# Altium schematic sheet Sheet1_V4.1.SchDoc
size A2
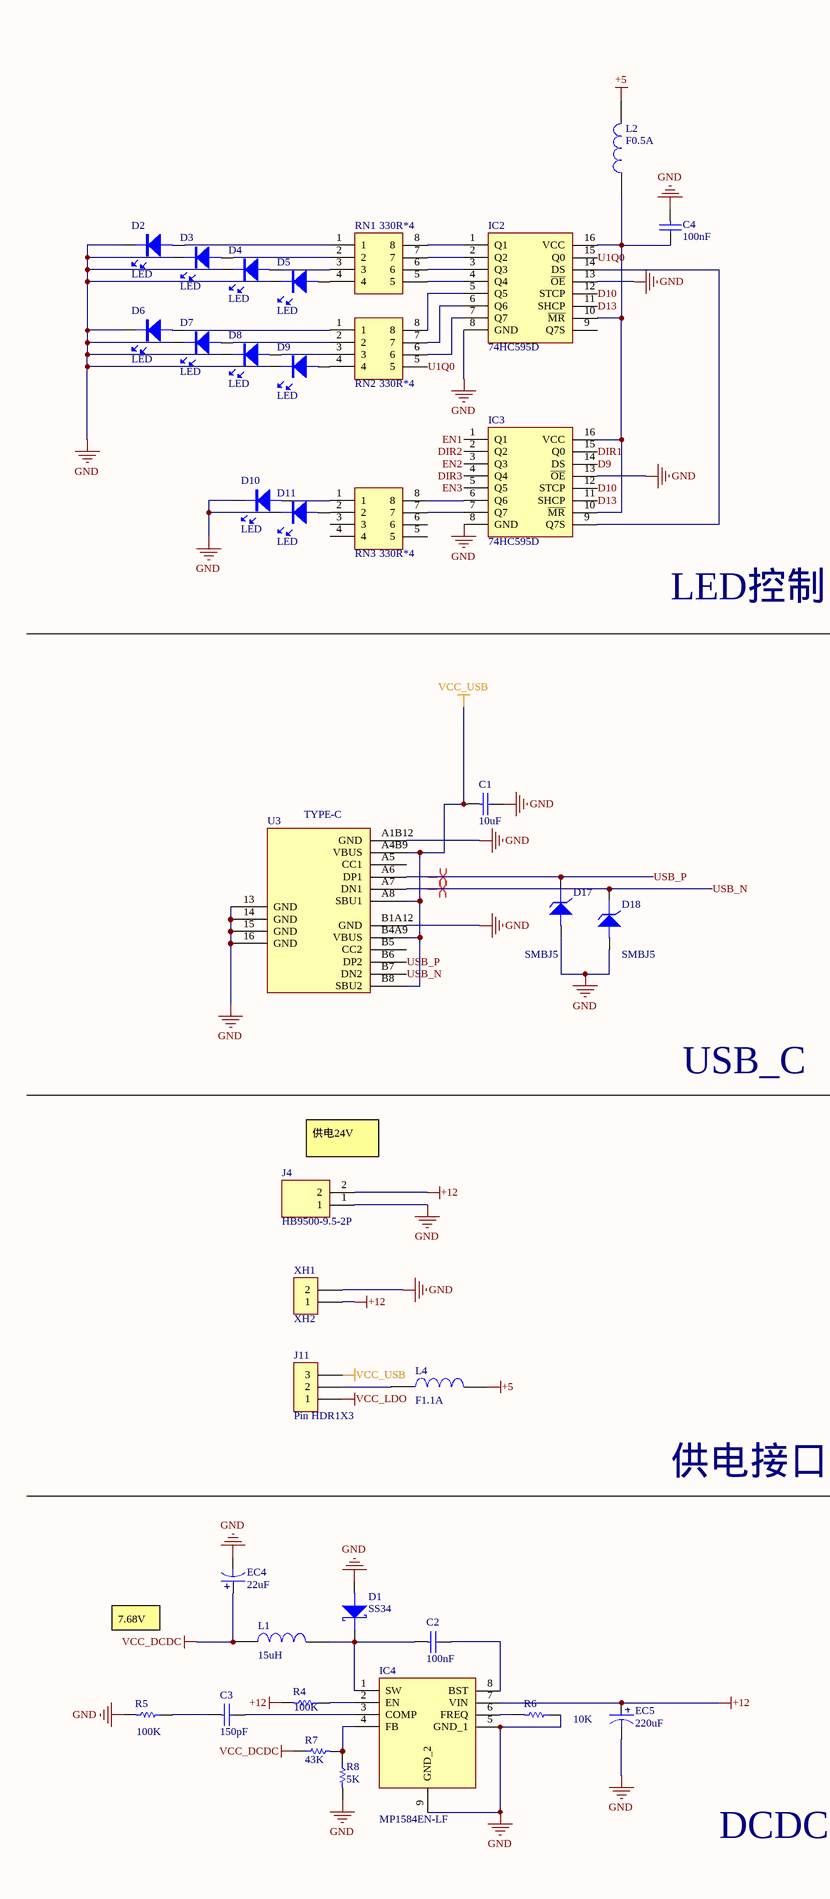
[diagram p0: Sheet1_V4.1.SchDoc, left]
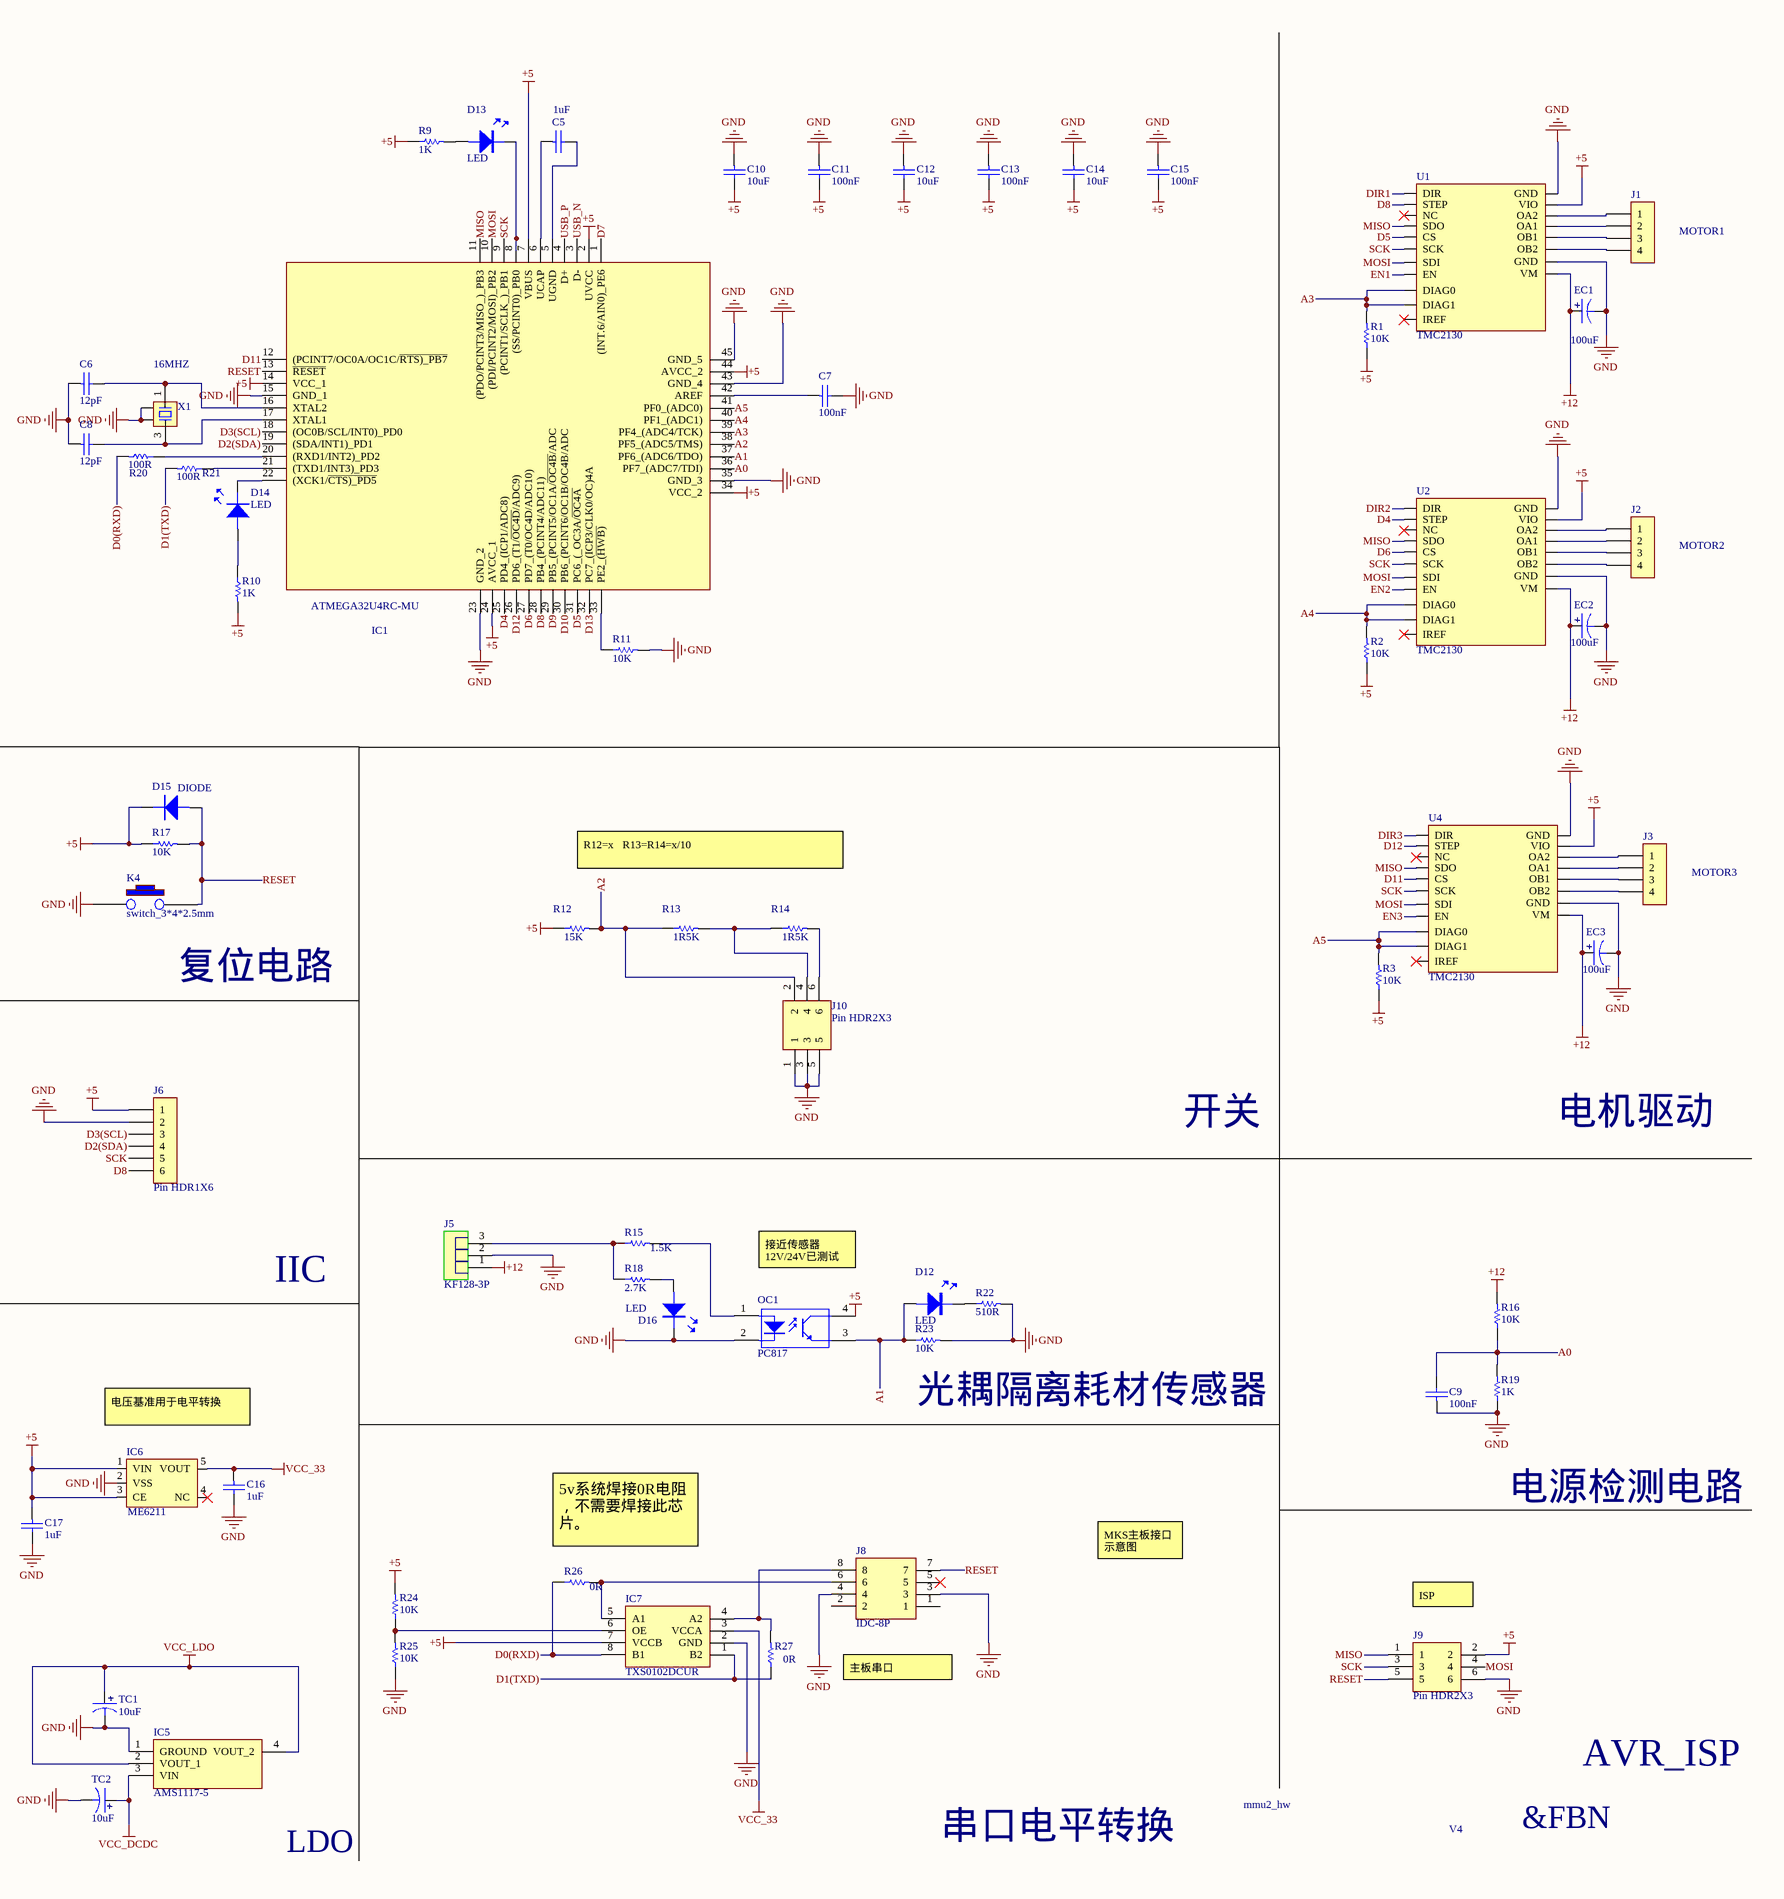
[diagram p1: Sheet1_V4.1.SchDoc, right]

## Parts
C1  10uF  [0402C]
C2  100nF  [0402C]
C3  150pF  [0402C]
C4  100nF  [0402C]
C5  1uF  [0402C]
C6  12pF  [0402C]
C7  100nF  [0402C]
C8  12pF  [0402C]
C9  100nF  [0402C]
C10  10uF  [0402C]
C11  100nF  [0402C]
C12  10uF  [0402C]
C13  100nF  [0402C]
C14  10uF  [0402C]
C15  100nF  [0402C]
C16  1uF  [0402C]
C17  1uF  [0402C]
D1  SS34  [SMA/DO-214AC]
D2  LED  [LED-0603G]
D3  LED  [LED-0603B]
D4  LED  [LED-0603G]
D5  LED  [LED-0603B]
D6  LED  [LED-0603G]
D7  LED  [LED-0603B]
D8  LED  [LED-0603G]
D9  LED  [LED-0603B]
D10  LED  [LED-0603G]
D11  LED  [LED-0603B]
D12  LED  [LED-0603G]
D13  LED  [LED-0603W]
D14  LED  [LED-0603G]
D15  DIODE  [SOD-123]
D16  LED  [LED-0603G]
D17  SMBJ5  [SOD-323]
D18  SMBJ5  [SOD-323]
EC1  100uF  [SMD-EC6.3X6.3X10]
EC2  100uF  [SMD-EC6.3X6.3X10]
EC3  100uF  [SMD-EC6.3X6.3X10]
EC4  22uF  [SMD-EC6.3X6.3X10]
EC5  220uF  [SMD-EC8X8X10]
IC1  ATMEGA32U4RC-MU  [QFN50P700X700X100-45N-D]
IC2  74HC595D  [SOIC127P600X175-16N]
IC3  74HC595D  [SOIC127P600X175-16N]
IC4  MP1584EN-LF  [SOIC127P600X170-9N]
IC5  AMS1117-5  [SOT229P700X180-4N]
IC6  ME6211  [SOT95P280X145-5N]
IC7  TXS0102DCUR  [SOP50P310X90-8N]
J1  MOTOR1  [Pin HDR1X4/2.54mm-S]
J2  MOTOR2  [Pin HDR1X4/2.54mm-S]
J3  MOTOR3  [Pin HDR1X4/2.54mm-S]
J4  HB9500-9.5-2P  [SHDR2W140P0X950_1X2_2055X1800X1440P]
J5  KF128-3P  [KF128-3.81-3P]
J6  Pin HDR1X6  [Pin HDR1X6/2.54mm-S]
J8  IDC-8P  [IDC2.54-8P]
J9  Pin HDR2X3  [Pin HDR2X3/2.54mm-S]
J10  Pin HDR2X3  [Pin HDR2X3/2.54mm-S]
J11  Pin HDR1X3  [Pin HDR1X3/2.54mm-S]
K4  switch_3*4*2.5mm  [switch_3*4*2.5mm]
L1  15uH  [0630L]
L2  F0.5A  [0805L]
L4  F1.1A  [0805L]
OC1  PC817  [SMD_PC817]
R1  10K  [0402R]
R2  10K  [0402R]
R3  10K  [0402R]
R4  100K  [0402R]
R5  100K  [0402R]
R6  10K  [0402R]
R7  43K  [0402R]
R8  5K  [0402R]
R9  1K  [0402R]
R10  1K  [0402R]
R11  10K  [0402R]
R12  15K  [0402R]
R13  1R5K  [0402R]
R14  1R5K  [0402R]
R15  1.5K  [0402R]
R16  10K  [0402R]
R17  10K  [0402R]
R18  2.7K  [0402R]
R19  1K  [0402R]
R20  100R  [0402R]
R21  100R  [0402R]
R22  510R  [0402R]
R23  10K  [0402R]
R24  10K  [0402R]
R25  10K  [0402R]
R26  0R  [0402R]
R27  0R  [0402R]
RN1  330R*4  [ACASA100021000P100]
RN2  330R*4  [ACASA100021000P100]
RN3  330R*4  [ACASA100021000P100]
TC1  10uF  [TAJ-A/3216]
TC2  10uF  [TAJ-A/3216]
U1  TMC2130  [TMC2130]
U2  TMC2130  [TMC2130]
U3  TYPE-C  [USB-C-SMD_TYPEC-304-BCP16]
U4  TMC2130  [TMC2130]
X1  16MHZ  [OSC 3225-4P]
XH1  XH2  [XH2/2.54mm/180]

## Nets
+5: C10.2 C11.2 C12.2 C13.2 C14.2 C15.2 C17.1 D15.K IC1.2(UVCC) IC1.7(VBUS) IC1.14(VCC_1) IC1.24(AVCC_1) IC1.34(VCC_2) IC1.44(AVCC_2) IC6.1(VIN) IC6.3(CE) IC7.7(VCCB) J6.1 J9.2 L2.2 L4.2 OC1.4(C) R1.1 R2.1 R3.1 R9.1 R10.2 R12.1 R17.1 R24.2 U1.2(VIO) U2.2(VIO) U4.2(VIO)
+12: EC1.1 EC2.1 EC3.1 EC5.1 IC4.7(VIN) J4.2 J5.1 R4.2 R16.2 U1.8(VM) U2.8(VM) U4.8(VM) XH1.1
GND: C1.2 C4.1 C6.1 C7.2 C8.1 C9.1 C10.1 C11.1 C12.1 C13.1 C14.1 C15.1 C16.2 C17.2 D1.A D2.K D3.K D4.K D5.K D6.K D7.K D8.K D9.K D10.K D11.K D16.K D17.A D18.A EC1.2 EC2.2 EC3.2 EC4.2 EC5.2 IC1.15(GND_1) IC1.23(GND_2) IC1.35(GND_3) IC1.43(GND_4) IC1.45(GND_5) IC2.8(GND) IC2.13(~{OE}) IC3.8(GND) IC3.13(~{OE}) IC4.5(GND_1) IC4.9(GND_2) IC5.1(GROUND) IC6.2(VSS) IC7.2(GND) J4.1 J5.2 J6.2 J8.3 J8.4 J9.6 J10.1 J10.3 J10.5 K4.1 OC1.2(K) R5.2 R6.1 R8.2 R11.2 R19.1 R22.2 R23.2 R25.1 TC1.2 TC2.2 U1.1(GND) U1.7(GND) U2.1(GND) U2.7(GND) U3.13(GND) U3.14(GND) U3.15(GND) U3.16(GND) U3.A1B12(GND) U3.B1A12(GND) U4.1(GND) U4.7(GND) X1.2 X1.4 XH1.2
VCC_33: C16.1 IC6.5(VOUT) IC7.3(VCCA)
VCC_DCDC: EC4.1 IC5.3(VIN) L1.1 R7.1 TC2.1
VCC_LDO: IC5.2(VOUT_1) IC5.4(VOUT_2) J11.1 TC1.1
VCC_USB: C1.1 J11.3 U3.A4B9(VBUS) U3.A8(SBU1) U3.B4A9(VBUS) U3.B8(SBU2)
A0: C9.2 IC1.36(PF7_(ADC7/TDI)) R16.1 R19.2
A1: D12.A IC1.37(PF6_(ADC6/TDO)) OC1.3(E) R23.1
A2: IC1.38(PF5_(ADC5/TMS)) J10.2 R12.2 R13.1
A3: IC1.39(PF4_(ADC4/TCK)) R1.2 U1.17(DIAG0) U1.18(DIAG1)
A4: IC1.40(PF1_(ADC1)) R2.2 U2.17(DIAG0) U2.18(DIAG1)
A5: IC1.41(PF0_(ADC0)) R3.2 U4.17(DIAG0) U4.18(DIAG1)
D0(RXD): IC7.8(B1) R20.2 R26.1
D1(TXD): IC7.1(B2) R21.2 R27.1
D2(SDA): IC1.19((SDA/INT1)_PD1) J6.4
D3(SCL): IC1.18((OC0B/SCL/INT0)_PD0) J6.3
D4: IC1.25(PD4_(ICP1/ADC8)) U2.15(STEP)
D5: IC1.31(PC6_(_OC3A/~{OC4A}) U1.12(CS)
D6: IC1.27(PD7_(T0/OC4D/ADC10)) U2.12(CS)
D7: IC1.1((INT.6/AIN0)_PE6)
D8: IC1.28(PB4_(PCINT4/ADC11)) J6.6 U1.15(STEP)
D9: IC1.29(PB5_(PCINT5/OC1A/~{OC4B}/ADC) IC3.14(DS)
D10: IC1.30(PB6_(PCINT6/OC1B/OC4B/ADC) IC2.12(STCP) IC3.12(STCP)
D11: IC1.12((PCINT7/OC0A/OC1C/~{RTS)_PB7}) U4.12(CS)
D12: IC1.26(PD6_(T1/~{OC4D}/ADC9)) U4.15(STEP)
D13: IC1.32(PC7_(ICP3/CLK0/OC)4A) IC2.11(SHCP) IC3.11(SHCP)
DIR1: IC3.15(Q0) U1.16(DIR)
DIR2: IC3.2(Q2) U2.16(DIR)
DIR3: IC3.4(Q4) U4.16(DIR)
EN1: IC3.1(Q1) U1.9(EN)
EN2: IC3.3(Q3) U2.9(EN)
EN3: IC3.5(Q5) U4.9(EN)
MISO: IC1.11((PDO/PCINT3/MISO_)_PB3) J9.1 U1.13(SDO) U2.13(SDO) U4.13(SDO)
MOSI: IC1.10((PDI/PCINT2/MOSI)_PB2) J9.4 U1.10(SDI) U2.10(SDI) U4.10(SDI)
RESET: D15.A IC1.13(~{RESET}) J8.7 J9.5 K4.2 R17.2
SCK: IC1.9((PCINT1/SCLK_)_PB1) J6.5 J9.3 U1.11(SCK) U2.11(SCK) U4.11(SCK)
U1Q0: IC2.15(Q0) RN2.5
USB_N: D18.K IC1.3(D-) U3.A7(DN1) U3.B7(DN2)
USB_P: D17.K IC1.4(D+) U3.A6(DP1) U3.B6(DP2)
NetC2_1: C2.1 D1.K IC4.1(SW) L1.2
NetC2_2: C2.2 IC4.8(BST)
NetC3_1: C3.1 R5.1
NetC3_2: C3.2 IC4.3(COMP)
NetC4_2: C4.2 IC2.10(~{MR}) IC2.16(VCC) IC3.10(~{MR}) IC3.16(VCC) L2.1
NetC5_1: C5.1 IC1.6(UCAP)
NetC5_2: C5.2 IC1.5(UGND)
NetC6_2: C6.2 IC1.16(XTAL2) X1.1
NetC7_1: C7.1 IC1.42(AREF)
NetC8_2: C8.2 IC1.17(XTAL1) X1.3
NetD2_A: D2.A RN1.1
NetD3_A: D3.A RN1.2
NetD4_A: D4.A RN1.3
NetD5_A: D5.A RN1.4
NetD6_A: D6.A RN2.1
NetD7_A: D7.A RN2.2
NetD8_A: D8.A RN2.3
NetD9_A: D9.A RN2.4
NetD10_A: D10.A RN3.1
NetD11_A: D11.A RN3.2
NetD12_K: D12.K R22.1
NetD13_A: D13.A R9.2
NetD13_K: D13.K IC1.8((SS/PCINT0)_PB0)
NetD14_A: D14.A R10.1
NetD14_K: D14.K IC1.22((XCK1/~{CTS)_PD5})
NetD16_A: D16.A R18.2
NetIC1_20: IC1.20((RXD1/INT2)_PD2) R20.1
NetIC1_21: IC1.21((TXD1/INT3)_PD3) R21.1
NetIC1_33: IC1.33(PE2_(~{HWB)}) R11.1
NetIC2_1: IC2.1(Q1) RN1.8
NetIC2_2: IC2.2(Q2) RN1.7
NetIC2_3: IC2.3(Q3) RN1.6
NetIC2_4: IC2.4(Q4) RN1.5
NetIC2_5: IC2.5(Q5) RN2.8
NetIC2_6: IC2.6(Q6) RN2.7
NetIC2_7: IC2.7(Q7) RN2.6
NetIC2_14: IC2.14(DS) IC3.9(Q7S)
NetIC3_6: IC3.6(Q6) RN3.8
NetIC3_7: IC3.7(Q7) RN3.7
NetIC4_2: IC4.2(EN) R4.1
NetIC4_4: IC4.4(FB) R7.2 R8.1
NetIC4_6: IC4.6(FREQ) R6.2
NetIC7_4: IC7.4(A2) J8.8 R27.2
NetIC7_5: IC7.5(A1) J8.6 R26.2
NetIC7_6: IC7.6(OE) R24.1 R25.2
NetJ1_1: J1.1 U1.3(OA2)
NetJ1_2: J1.2 U1.4(OA1)
NetJ1_3: J1.3 U1.5(OB1)
NetJ1_4: J1.4 U1.6(OB2)
NetJ2_1: J2.1 U2.3(OA2)
NetJ2_2: J2.2 U2.4(OA1)
NetJ2_3: J2.3 U2.5(OB1)
NetJ2_4: J2.4 U2.6(OB2)
NetJ3_1: J3.1 U4.3(OA2)
NetJ3_2: J3.2 U4.4(OA1)
NetJ3_3: J3.3 U4.5(OB1)
NetJ3_4: J3.4 U4.6(OB2)
NetJ5_3: J5.3 R15.1 R18.1
NetJ10_4: J10.4 R13.2 R14.1
NetJ10_6: J10.6 R14.2
NetJ11_2: J11.2 L4.1
NetOC1_1: OC1.1(A) R15.2

Not connected (* = marked no-connect by the designer): IC2 9(Q7S); IC6 4(NC)*; J8 1 2 5*; RN3 3 4 5 6; U1 14(NC)* 19(IREF)*; U2 14(NC)* 19(IREF)*; U3 A5(CC1) B5(CC2); U4 14(NC)* 19(IREF)*

## Layout directives
differential pair: USB_N, USB_P

## Notes on the sheet
- LED控制
- R12=x   R13=R14=x/10
- (near K4) 复位电路
- USB_C
- 开关
- 电机驱动
- (near J4) 供电24V
- IIC
- 接近传感器12V/24V已测试
- 电压基准用于电平转换
- (near R23) 光耦隔离耗材传感器
- 供电接口
- (near R26) 5v系统焊接0R电阻，不需要焊接此芯片。
- MKS主板接口示意图
- 电源检测电路
- ISP
- 7.68V
- 主板串口
- AVR_ISP
- DCDC
- LDO
- 串口电平转换
- mmu2_hw
- V4
- &FBN
- Title
- Size:
- Date:
- File:
- A2
- Number:
- Time:
- Revision:
- Sheet
- of

## Library data of the parts
C1-C17 = CAP: 无极性电容
D1 = DIODE SCHOTTKY: 肖特基二极管
D15 = DIODE: 普通二极管
D17 D18 = DIODE ZENER: 稳压二极管
EC1-EC5 = SMD_ECAP: 贴片电解电容
IC1 = ATMEGA32U4RC-MU: Integrated Circuit; Manufacturer_Name: Microchip; Datasheet Link: http://ww1.microchip.com/downloads/en/DeviceDoc/Atmel-7766-8-bit-AVR-ATmega16U4-32U4_Datasheet.pdf; Height: 1mm; Manufacturer_Part_Number: ATMEGA32U4RC-MU; Mouser Part Number: 556-ATMEGA32U4RC-MU; Mouser Price/Stock: https://www.mouser.co.uk/ProductDetail/Microchip-Technology-Atmel/ATMEGA32U4RC-MU?qs=7AReRZHh%2FSu01hzuv0rGvg%3D%3D; Arrow Part Number: ATMEGA32U4RC-MU; Arrow Price/Stock: https://www.arrow.com/en/products/atmega32u4rc-mu/microchip-technology?region=nac
IC2 IC3 = 74HC595D: Integrated Circuit; Manufacturer_Name: Nexperia; Datasheet Link: https://componentsearchengine.com/Datasheets/2/74HC595D.pdf; Height: 1.75mm; Manufacturer_Part_Number: 74HC595D; Mouser Part Number: N/A; Mouser Price/Stock: https://www.mouser.com/Search/Refine.aspx?Keyword=N%2FA
IC4 = MP1584EN-LF: Integrated Circuit; Manufacturer_Name: Monolithic Power Systems (MPS); Datasheet Link: https://componentsearchengine.com/Datasheets/1/MP1584EN-LF.pdf; Height: 1.7mm; Manufacturer_Part_Number: MP1584EN-LF; Mouser Part Number: 946-MP1584ENLF; Mouser Price/Stock: https://www.mouser.com/Search/Refine.aspx?Keyword=946-MP1584ENLF
IC5 = AMS1117: Integrated Circuit; Manufacturer_Name: Advanced Monolithic Systems; Datasheet Link: https://datasheet.lcsc.com/szlcsc/Advanced-Monolithic-Systems-AMS-AMS1117-ADJ_C6188.pdf; Height: 1.8mm; Manufacturer_Part_Number: AMS1117
IC7 = TXS0102DCUR: Integrated Circuit; Manufacturer_Name: Texas Instruments; Datasheet Link: https://datasheet.datasheetarchive.com/originals/distributors/SFDatasheet-7/sf-000145437.pdf; Height: 0.9mm; Manufacturer_Part_Number: TXS0102DCUR; Mouser Part Number: 595-TXS0102DCUR; Mouser Price/Stock: https://www.mouser.co.uk/ProductDetail/Texas-Instruments/TXS0102DCUR?qs=dB0LedT%252BmmBcQ3I%2Fs9XEDA%3D%3D; Arrow Part Number: TXS0102DCUR; Arrow Price/Stock: https://www.arrow.com/en/products/txs0102dcur/texas-instruments?region=nac
J1-J3 = Pin HDR1X4
J4 = HB9500-9.5-2P: Connector; Manufacturer_Name: Ningbo Kangnex; Datasheet Link: https://datasheet.lcsc.com/szlcsc/Ningbo-Kangnex-Elec-Ningbo-Kangnex-Elec-HB9500-2P-black_C60785.pdf; Height: 14.4mm; Manufacturer_Part_Number: HB9500-9.5-2P
L1 L2 L4 = INDUCTOR
OC1 = PC817: 线性光耦
R1-R27 = RES
RN1-RN3 = ACASA1000S1000P1AT: Resistor Network; Manufacturer_Name: Vishay; Datasheet Link: https://datasheet.datasheetarchive.com/originals/distributors/Datasheets-DGA22/1467501.pdf; Height: 0mm; Manufacturer_Part_Number: ACASA1000S1000P1AT; Mouser Part Number: 594-ACASA1000S1000AT; Mouser Price/Stock: https://www.mouser.co.uk/ProductDetail/Vishay-Beyschlag/ACASA1000S1000P1AT?qs=abmNkq9no6C1dLc15uJVoQ%3D%3D; Arrow Part Number: ACASA1000S1000P1AT; Arrow Price/Stock: https://www.arrow.com/en/products/acasa1000s1000p1at/vishay
TC1 TC2 = TCAP: 钽电容
U3 = TYPEC-304-BCP16
X1 = XTAL-4P: 4脚无源晶振